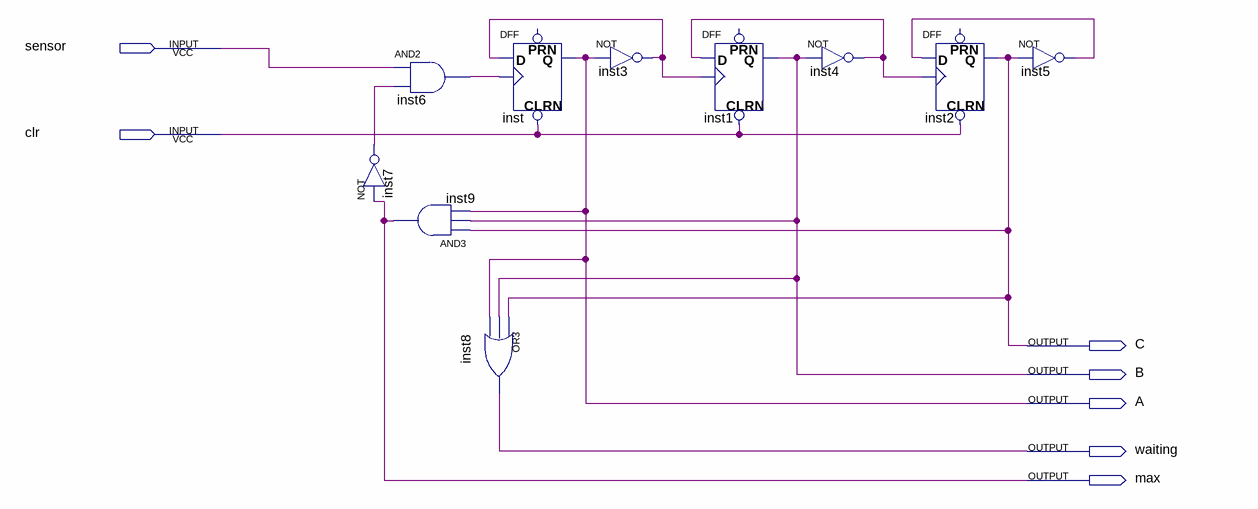
[diagram p0: schematic sheet]
// Quartus schematic PC.bdf as structural Verilog: 10 symbols, 7 pins
module PC (
  input  sensor,
  input  clr,
  output C,
  output B,
  output A,
  output waiting,
  output max
);

  wire inst3_out, inst4_out, inst5_out, inst6_out, inst7_out;

  and inst6 (inst6_out, sensor, inst7_out);
  not inst7 (inst7_out, max);
  and inst9 (max, C, B, A);
  DFF inst (.CLRN(clr), .CLK(inst6_out), .D(inst3_out), .Q(A));  // open: PRN
  or inst8 (waiting, C, B, A);
  not inst3 (inst3_out, A);
  DFF inst1 (.CLRN(clr), .CLK(inst3_out), .D(inst4_out), .Q(B));  // open: PRN
  not inst4 (inst4_out, B);
  DFF inst2 (.CLRN(clr), .CLK(inst4_out), .D(inst5_out), .Q(C));  // open: PRN
  not inst5 (inst5_out, C);
endmodule
